# EAGLE schematic untitled (EAGLE 9.3.0)
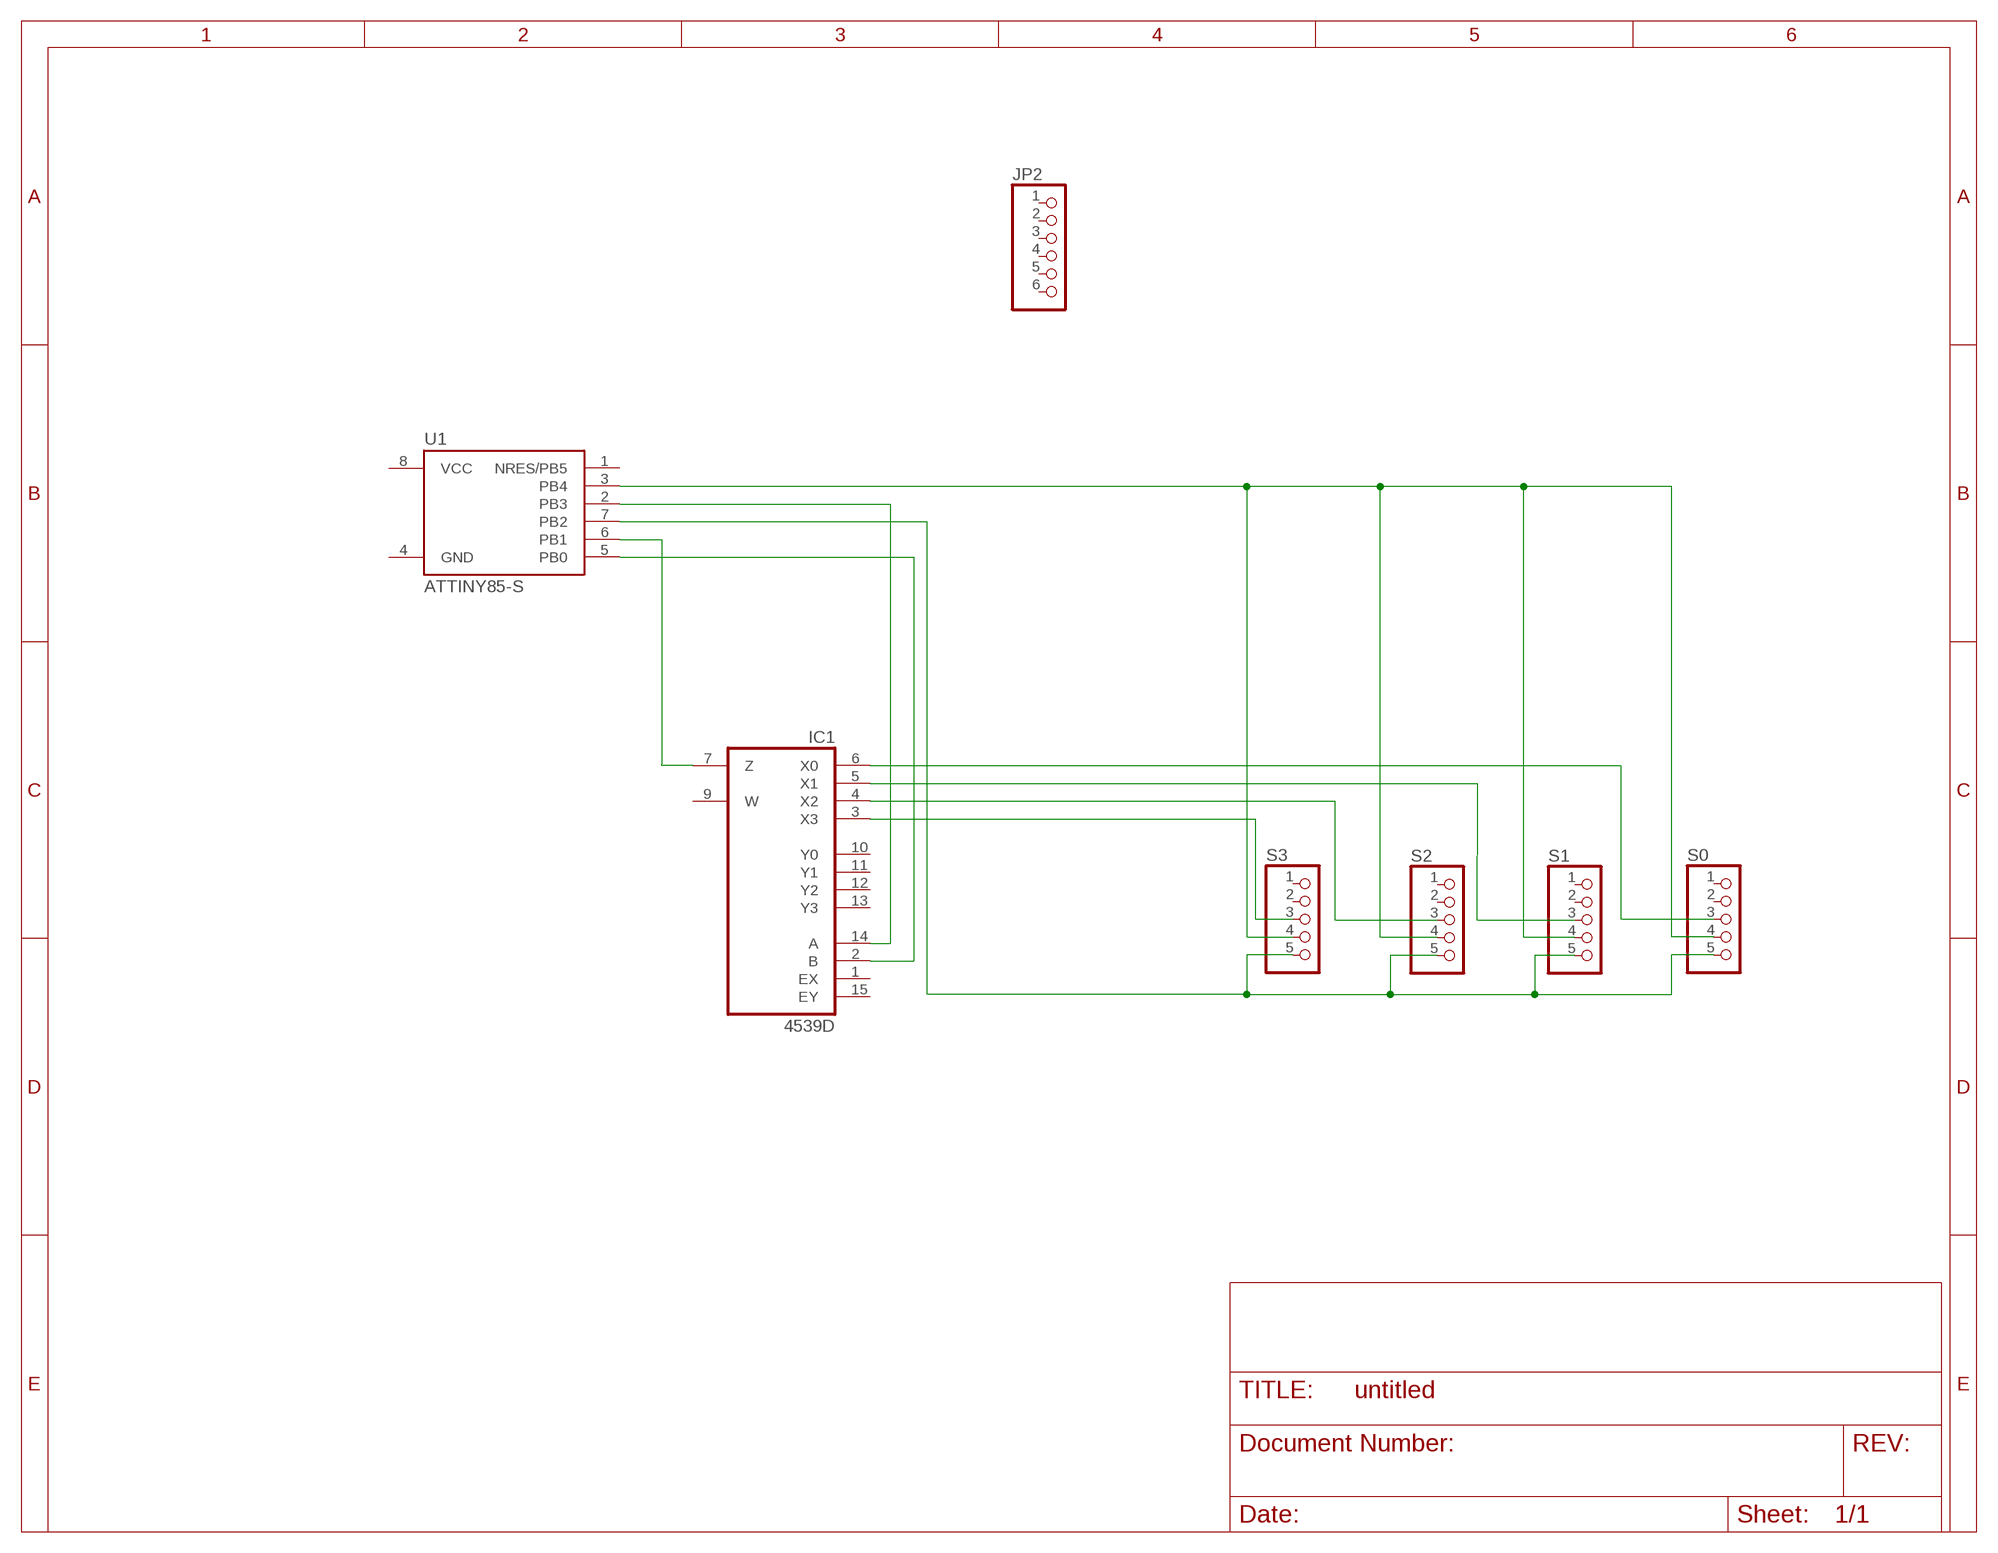
[diagram p0: schematic, sheet 1]

## Parts
IC1  4539D  [SO16]
JP2  PINHD-1X6  [1X06]
S0  PINHD-1X5  [1X05]
S1  PINHD-1X5  [1X05]
S2  PINHD-1X5  [1X05]
S3  PINHD-1X5  [1X05]
U1  ATTINY85-S  [SOIC8_EIAJ_208MIL]

## Nets
N$1: IC1.7(Z) U1.6(PB1)
N$2: IC1.2(B) U1.5(PB0)
N$4: IC1.4(X2) S2.3
N$5: S0.4 S1.4 S2.4 S3.4 U1.3(PB4)
N$6: S0.3
N$8: IC1.5(X1) S1.3
N$9: IC1.3(X3) S3.3
N$10: IC1.14(A) U1.2(PB3)
N$11: IC1.6(X0)
N$12: S3.5
N$14: S0.5 S1.5 S2.5 U1.7(PB2)
Unconnected: IC1.1(EX) IC1.9(W) IC1.10(Y0) IC1.11(Y1) IC1.12(Y2) IC1.13(Y3) IC1.15(EY) JP2.1 JP2.2 JP2.3 JP2.4 JP2.5 JP2.6 S0.1 S0.2 S1.1 S1.2 S2.1 S2.2 S3.1 S3.2 U1.1(NRES/PB5)

## Power pins joined to a net without a drawn wire
GND: U1.4(GND)
VCC: U1.8(VCC)
VDD: IC1.16(VDD)
VSS: IC1.8(VSS)

## Library data of the parts
IC1 = 45xx:4539: Dual 4-channel DATA SELECTOR/MULTIPLEXER
JP2 = pinhead:PINHD-1X6: PIN HEADER
S0 S1-S3 = pinhead:PINHD-1X5: PIN HEADER
U1 = _hhn_attiny25_45_85:ATTINY85*: ATMEL ATtiny 85 Packages: P = PDIP 08 30mil S = SOIC 08 EIAJ 208mil Technologies Note: for complete ordering code (temp. range, finish, tape&reel etc.) see www.atmel.com • Supply Voltage: V = (1.8…5.5)V | [blank] = (2.7…5.5)V • Speed: 10 = 10 MHz | 20 = 20 MHz Author: Dipl.-Ing. FH Rainer Bayer HHN Hochschule Heilbronn (Heilbronn University), rainer.bayer@hs-heilbronn.de Ingenieurbüro ing-rb, mail@ing-rb.de